# Altium schematic sheet JS7628_base_microSD_v1.0.SchDoc
size A4
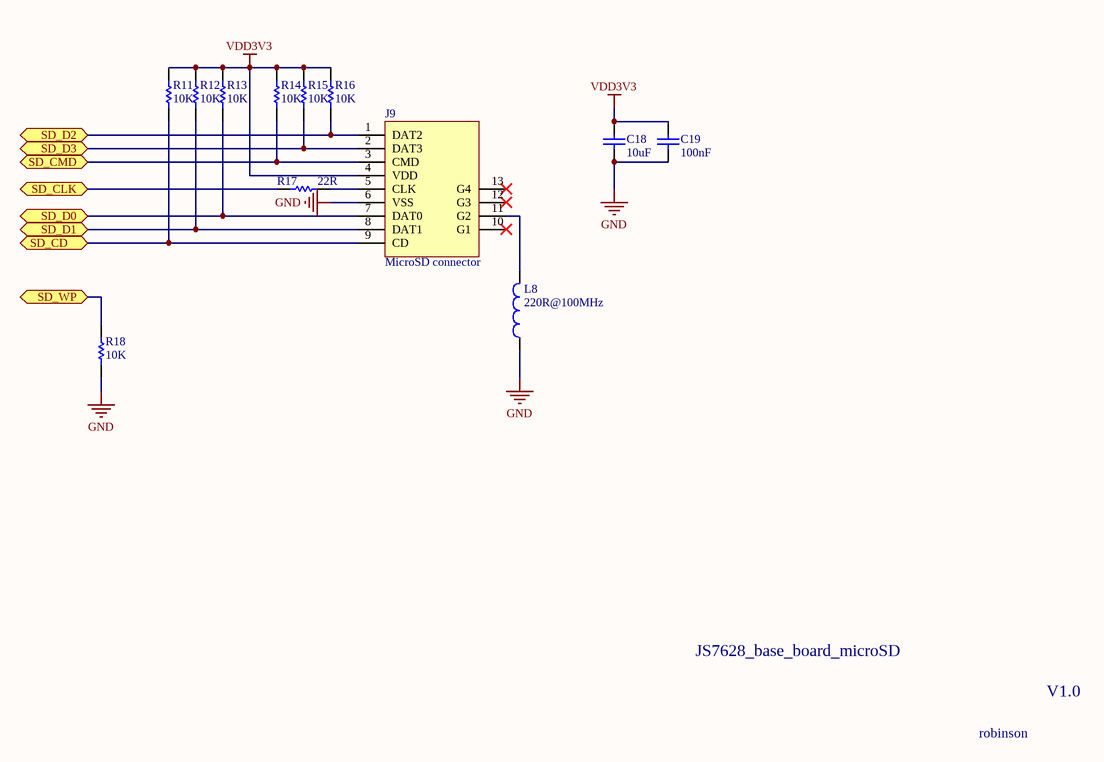
[diagram p0: JS7628_base_microSD_v1.0.SchDoc]

## Parts
C18  value 10uF  [0603]  (hidden comment: CAP-SMT)
C19  value 100nF  [0603]  (hidden comment: CAP-SMT)
J9  MicroSD connector  [MicroSD_connecter]
L8  value 220R@100MHz  [0603]  (hidden comment: inductor)
R11  value 10K  [0603]  (hidden comment: RES-SMT)
R12  value 10K  [0603]  (hidden comment: RES-SMT)
R13  value 10K  [0603]  (hidden comment: RES-SMT)
R14  value 10K  [0603]  (hidden comment: RES-SMT)
R15  value 10K  [0603]  (hidden comment: RES-SMT)
R16  value 10K  [0603]  (hidden comment: RES-SMT)
R17  value 22R  [0603]  (hidden comment: RES-SMT)
R18  value 10K  [0603]  (hidden comment: RES-SMT)

## Ports
SD_CD, SD_CLK, SD_CMD, SD_D0, SD_D1, SD_D2, SD_D3, SD_WP

## Nets
GND: C18.1 C19.1 J9.6(VSS) L8.1 R18.1
VDD3V3: C18.2 C19.2 J9.4(VDD) R11.2 R12.2 R13.2 R14.2 R15.2 R16.2
SD_CD: J9.9(CD) R11.1 ; port SD_CD
SD_CLK: R17.2 ; port SD_CLK
SD_CMD: J9.3(CMD) R14.1 ; port SD_CMD
SD_D0: J9.7(DAT0) R13.1 ; port SD_D0
SD_D1: J9.8(DAT1) R12.1 ; port SD_D1
SD_D2: J9.1(DAT2) R16.1 ; port SD_D2
SD_D3: J9.2(DAT3) R15.1 ; port SD_D3
SD_WP: R18.2 ; port SD_WP
NetJ9_5: J9.5(CLK) R17.1
NetJ9_11: J9.11(G2) L8.2

Not connected (* = marked no-connect by the designer): J9 10(G1)* 12(G3)* 13(G4)*

## Notes on the sheet
- JS7628_base_board_microSD
- V1.0
- robinson